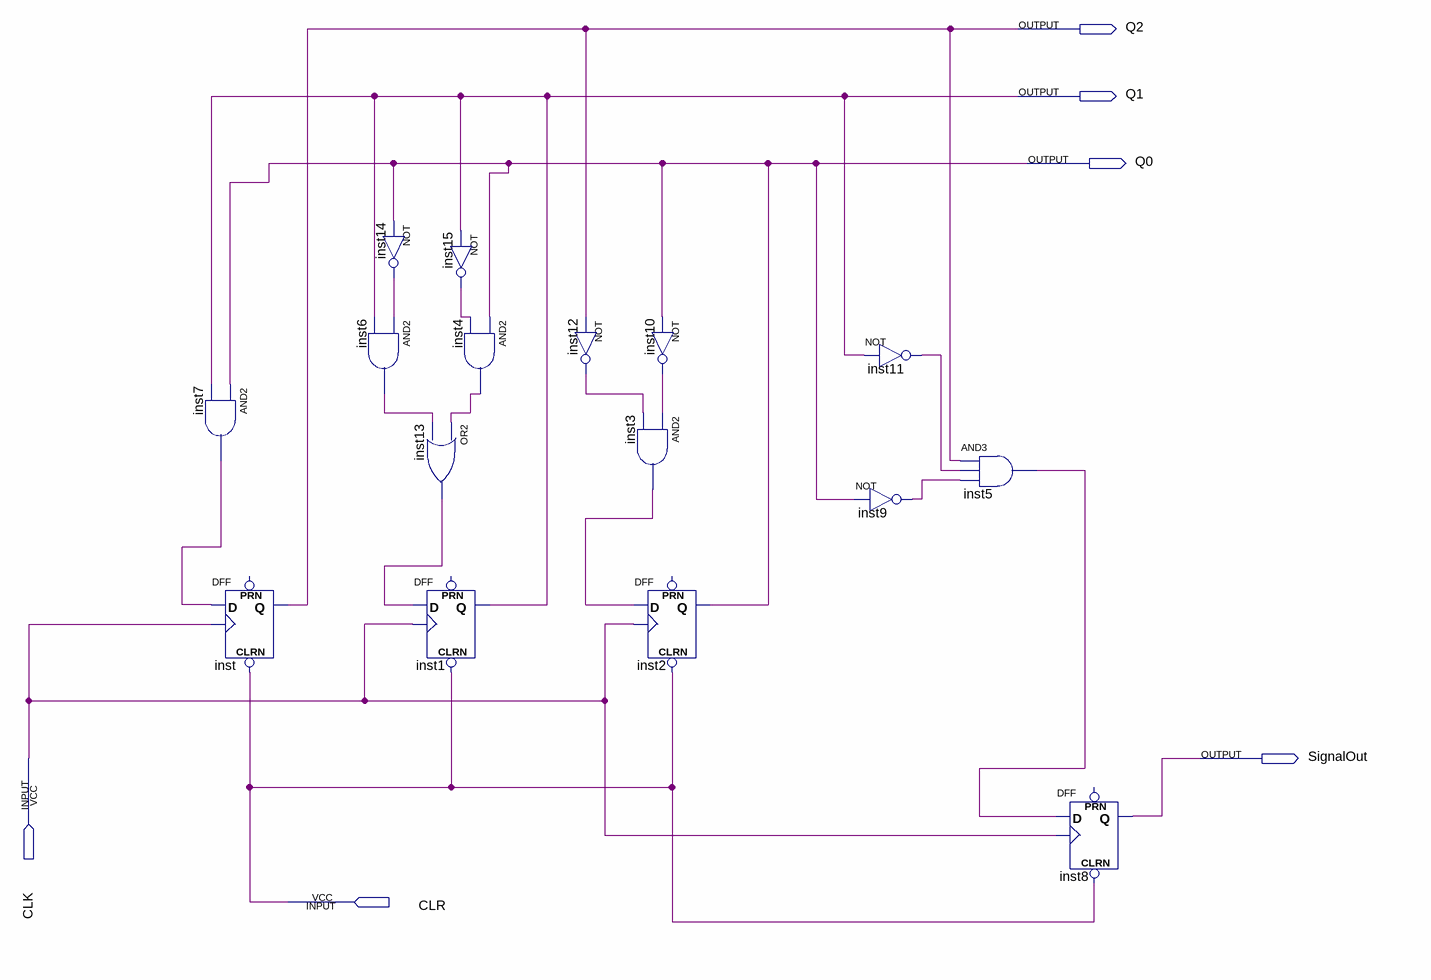
[diagram p0: schematic sheet]
// Quartus schematic mod5_lab6.bdf as structural Verilog: 16 symbols, 6 pins
module mod5_lab6 (
  input  CLK,
  input  CLR,
  output Q2,
  output Q1,
  output Q0,
  output SignalOut
);

  wire inst3_out, inst4_out, inst5_out, inst6_out, inst7_out, inst9_out, inst10_out, inst11_out, inst12_out,
       inst13_out, inst14_out, inst15_out;

  and inst7 (inst7_out, Q0, Q1);
  DFF inst (.CLRN(CLR), .CLK(CLK), .D(inst7_out), .Q(Q2));  // open: PRN
  not inst14 (inst14_out, Q0);
  and inst6 (inst6_out, inst14_out, Q1);
  or inst13 (inst13_out, inst4_out, inst6_out);
  DFF inst1 (.CLRN(CLR), .CLK(CLK), .D(inst13_out), .Q(Q1));  // open: PRN
  not inst15 (inst15_out, Q1);
  and inst4 (inst4_out, Q0, inst15_out);
  not inst12 (inst12_out, Q2);
  not inst10 (inst10_out, Q0);
  and inst3 (inst3_out, inst10_out, inst12_out);
  DFF inst2 (.CLRN(CLR), .CLK(CLK), .D(inst3_out), .Q(Q0));  // open: PRN
  not inst11 (inst11_out, Q1);
  not inst9 (inst9_out, Q0);
  and inst5 (inst5_out, Q2, inst11_out, inst9_out);
  DFF inst8 (.CLRN(CLR), .CLK(CLK), .D(inst5_out), .Q(SignalOut));  // open: PRN
endmodule
